# EAGLE design Teensy-Maxuino-Master (EAGLE 6.4)
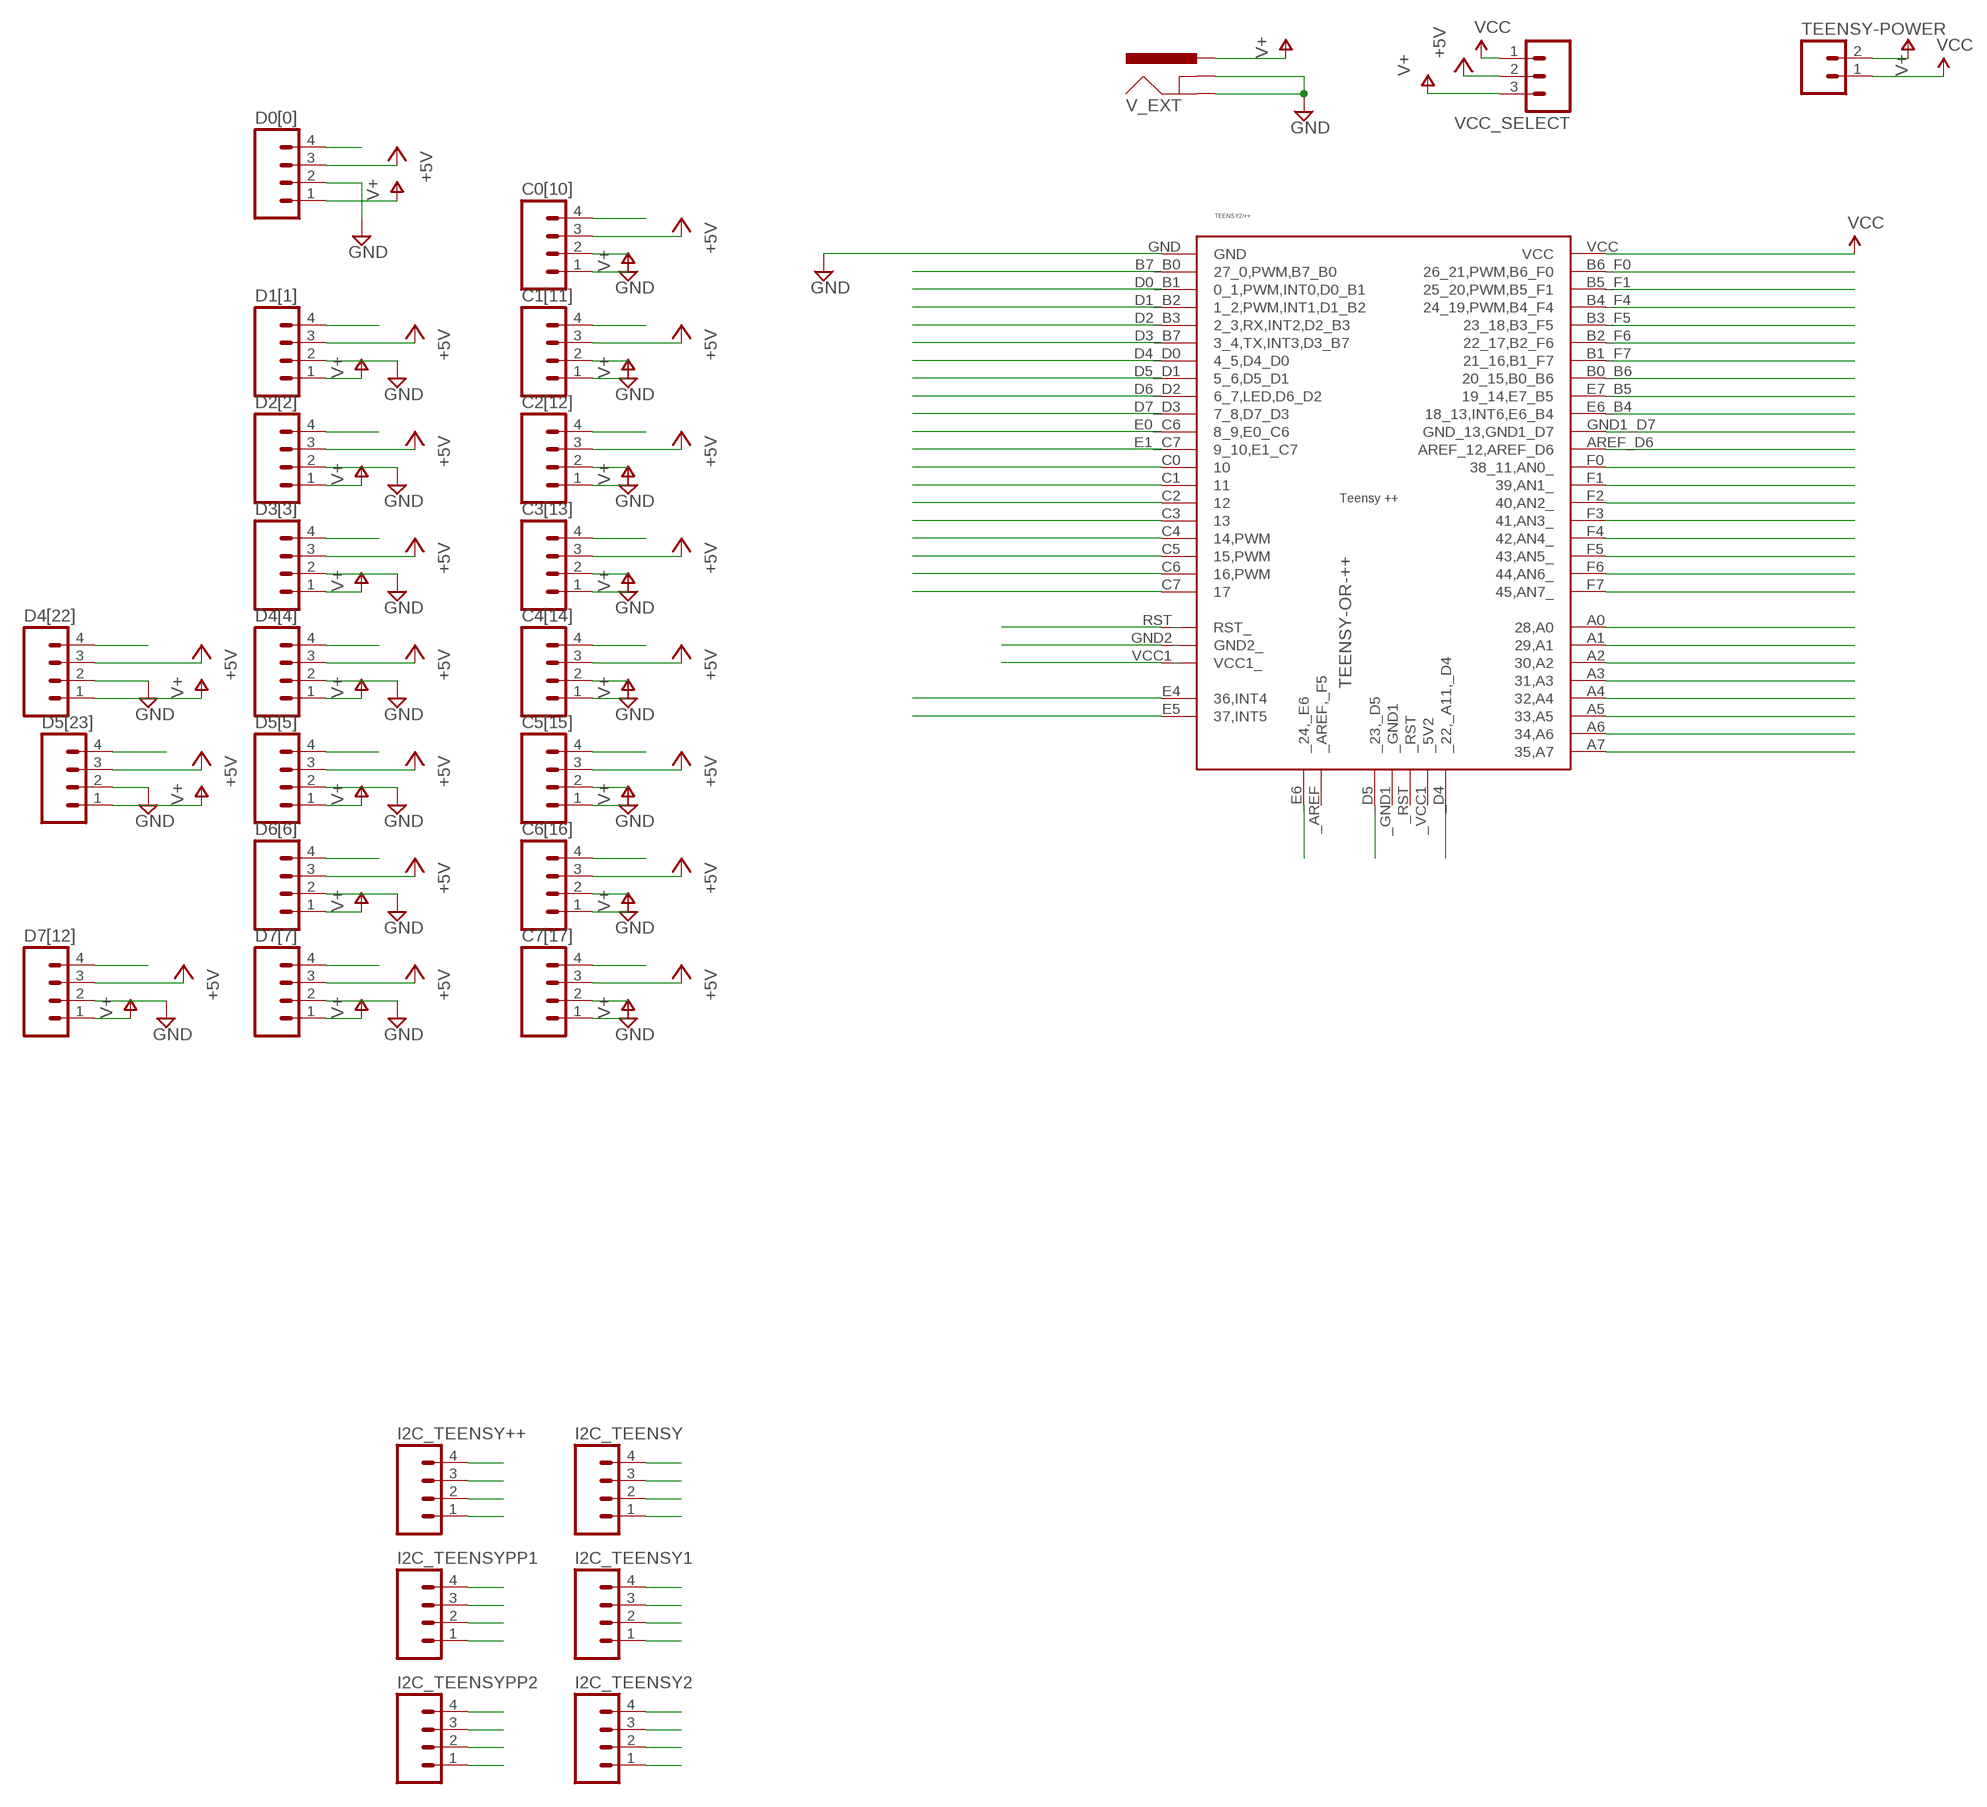
[diagram p0: schematic, sheet 1, part 1 of 2]
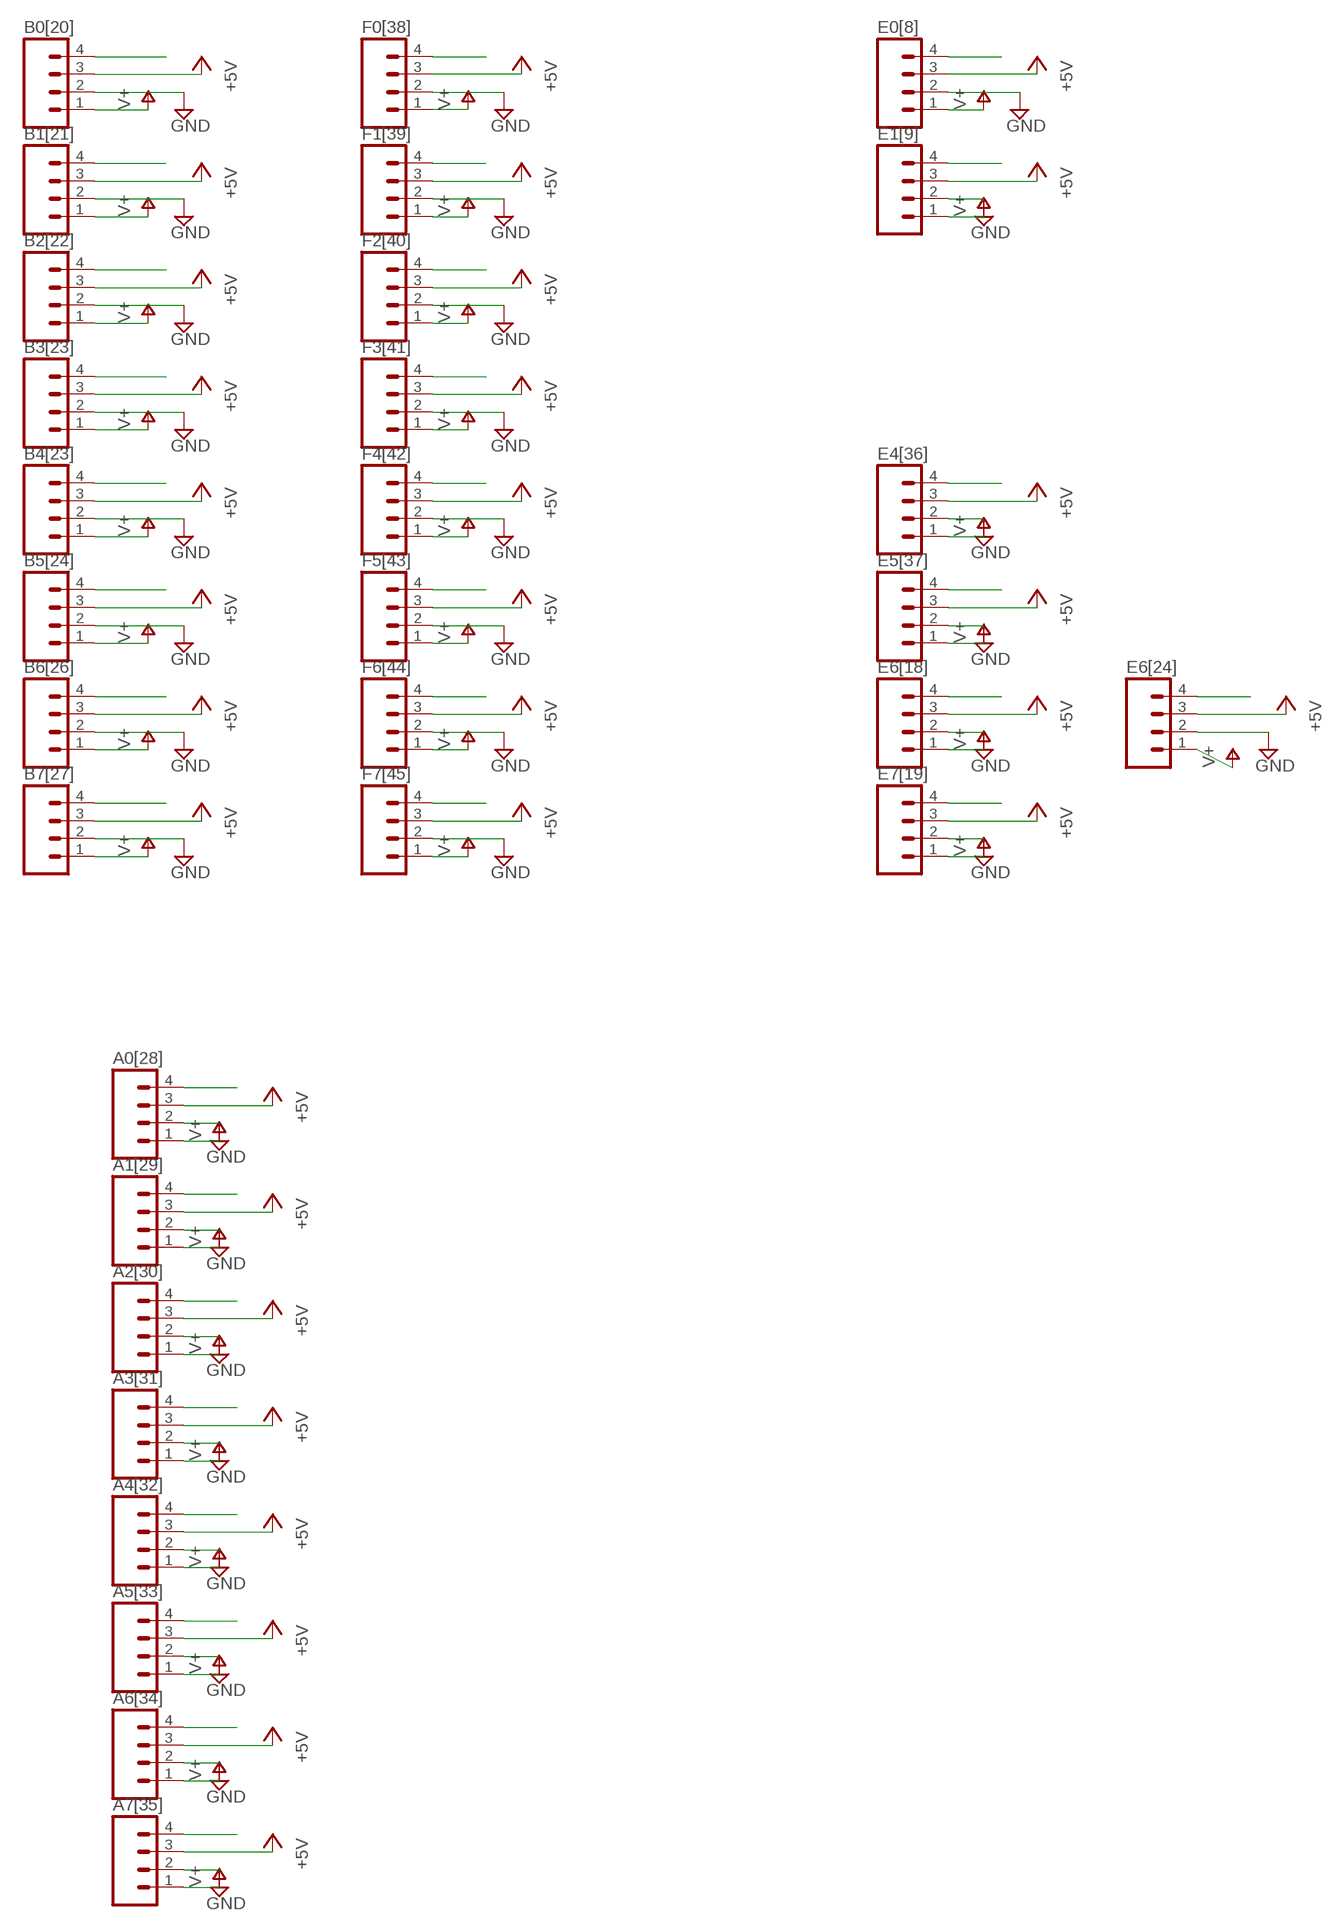
[diagram p1: schematic, sheet 1, part 2 of 2]

## Parts
A0[28]  M04PTH  [1X04]
A1[29]  M04PTH  [1X04]
A2[30]  M04PTH  [1X04]
A3[31]  M04PTH  [1X04]
A4[32]  M04PTH  [1X04]
A5[33]  M04PTH  [1X04]
A6[34]  M04PTH  [1X04]
A7[35]  M04PTH  [1X04]
B0[20]  M04PTH  [1X04]
B1[21]  M04PTH  [1X04]
B2[22]  M04PTH  [1X04]
B3[23]  M04PTH  [1X04]
B4[23]  M04PTH  [1X04]
B5[24]  M04PTH  [1X04]
B6[26]  M04PTH  [1X04]
B7[27]  M04PTH  [1X04]
C0[10]  M04PTH  [1X04]
C1[11]  M04PTH  [1X04]
C2[12]  M04PTH  [1X04]
C3[13]  M04PTH  [1X04]
C4[14]  M04PTH  [1X04]
C5[15]  M04PTH  [1X04]
C6[16]  M04PTH  [1X04]
C7[17]  M04PTH  [1X04]
D0[0]  M04PTH  [1X04]
D1[1]  M04PTH  [1X04]
D2[2]  M04PTH  [1X04]
D3[3]  M04PTH  [1X04]
D4[4]  M04PTH  [1X04]
D4[22]  M04PTH  [1X04]
D5[5]  M04PTH  [1X04]
D5[23]  M04PTH  [1X04]
D6[6]  M04PTH  [1X04]
D7[7]  M04PTH  [1X04]
D7[12]  M04PTH  [1X04]
E0[8]  M04PTH  [1X04]
E1[9]  M04PTH  [1X04]
E4[36]  M04PTH  [1X04]
E5[37]  M04PTH  [1X04]
E6[18]  M04PTH  [1X04]
E6[24]  M04PTH  [1X04]
E7[19]  M04PTH  [1X04]
F0[38]  M04PTH  [1X04]
F1[39]  M04PTH  [1X04]
F2[40]  M04PTH  [1X04]
F3[41]  M04PTH  [1X04]
F4[42]  M04PTH  [1X04]
F5[43]  M04PTH  [1X04]
F6[44]  M04PTH  [1X04]
F7[45]  M04PTH  [1X04]
I2C_TEENSY  M04PTH  [1X04]
I2C_TEENSY1  M04PTH  [1X04]
I2C_TEENSY2  M04PTH  [1X04]
I2C_TEENSY++  M04PTH  [1X04]
I2C_TEENSYPP1  M04PTH  [1X04]
I2C_TEENSYPP2  M04PTH  [1X04]
TEENSY2/++  TEENSY-OR-++  [TEENSY-OR-++]
TEENSY-POWER  M02PTH  [1X02]
V_EXT  POWER_JACKPTH  [POWER_JACK_PTH]
VCC_SELECT  M03PTH  [1X03]

## Nets
+5V [Power]: A0[28].3 A1[29].3 A2[30].3 A3[31].3 A4[32].3 A5[33].3 A6[34].3 A7[35].3 B0[20].3 B1[21].3 B2[22].3 B3[23].3 B4[23].3 B5[24].3 B6[26].3 B7[27].3 C0[10].3 C1[11].3 C2[12].3 C3[13].3 C4[14].3 C5[15].3 C6[16].3 C7[17].3 D0[0].3 D1[1].3 D2[2].3 D3[3].3 D4[4].3 D4[22].3 D5[5].3 D5[23].3 D6[6].3 D7[7].3 D7[12].3 E0[8].3 E1[9].3 E4[36].3 E5[37].3 E6[18].3 E6[24].3 E7[19].3 F0[38].3 F1[39].3 F2[40].3 F3[41].3 F4[42].3 F5[43].3 F6[44].3 F7[45].3 VCC_SELECT.2
_D4: D4[22].4 TEENSY2/++._D4(_22,_A11,_D4)
_D5: D5[23].4 TEENSY2/++._D5(_23,_D5)
_E6: E6[24].4 TEENSY2/++._E6(_24,_E6)
A0: A0[28].4 TEENSY2/++.A0(28,A0)
A1: A1[29].4 TEENSY2/++.A1(29,A1)
A2: A2[30].4 TEENSY2/++.A2(30,A2)
A3: A3[31].4 TEENSY2/++.A3(31,A3)
A4: A4[32].4 TEENSY2/++.A4(32,A4)
A5: A5[33].4 TEENSY2/++.A5(33,A5)
A6: A6[34].4 TEENSY2/++.A6(34,A6)
A7: A7[35].4 TEENSY2/++.A7(35,A7)
AREF_D6: TEENSY2/++.AREF_D6(AREF_12,AREF_D6)
B0_B6: B0[20].4 TEENSY2/++.B0_B6(20_15,B0_B6)
B1_F7: B1[21].4 TEENSY2/++.B1_F7(21_16,B1_F7)
B2_F6: B2[22].4 TEENSY2/++.B2_F6(22_17,B2_F6)
B3_F5: B3[23].4 TEENSY2/++.B3_F5(23_18,B3_F5)
B4_F4: B4[23].4 TEENSY2/++.B4_F4(24_19,PWM,B4_F4)
B5_F1: B5[24].4 TEENSY2/++.B5_F1(25_20,PWM,B5_F1)
B6_F0: B6[26].4 TEENSY2/++.B6_F0(26_21,PWM,B6_F0)
B7_B0: B7[27].4 TEENSY2/++.B7_B0(27_0,PWM,B7_B0)
C0: C0[10].4 TEENSY2/++.C0
C1: C1[11].4 TEENSY2/++.C1
C2: C2[12].4 TEENSY2/++.C2
C3: C3[13].4 TEENSY2/++.C3
C4: C4[14].4 TEENSY2/++.C4(14,PWM)
C5: C5[15].4 TEENSY2/++.C5(15,PWM)
C6: C6[16].4 TEENSY2/++.C6(16,PWM)
C7: C7[17].4 TEENSY2/++.C7
D0_B1: D0[0].4 I2C_TEENSY++.4 I2C_TEENSYPP1.4 I2C_TEENSYPP2.4 TEENSY2/++.D0_B1(0_1,PWM,INT0,D0_B1)
D1_B2: D1[1].4 I2C_TEENSY++.3 I2C_TEENSYPP1.3 I2C_TEENSYPP2.3 TEENSY2/++.D1_B2(1_2,PWM,INT1,D1_B2)
D2_B3: D2[2].4 TEENSY2/++.D2_B3(2_3,RX,INT2,D2_B3)
D3_B7: D3[3].4 TEENSY2/++.D3_B7(3_4,TX,INT3,D3_B7)
D4_D0: D4[4].4 I2C_TEENSY1.4 I2C_TEENSY2.4 I2C_TEENSY.4 TEENSY2/++.D4_D0(4_5,D4_D0)
D5_D1: D5[5].4 I2C_TEENSY1.3 I2C_TEENSY2.3 I2C_TEENSY.3 TEENSY2/++.D5_D1(5_6,D5_D1)
D6_D2: D6[6].4 TEENSY2/++.D6_D2(6_7,LED,D6_D2)
D7_D3: D7[7].4 TEENSY2/++.D7_D3(7_8,D7_D3)
E0_C6: E0[8].4 TEENSY2/++.E0_C6(8_9,E0_C6)
E1_C7: E1[9].4 TEENSY2/++.E1_C7(9_10,E1_C7)
E4: E4[36].4 TEENSY2/++.E4(36,INT4)
E5: E5[37].4 TEENSY2/++.E5(37,INT5)
E6_B4: E6[18].4 TEENSY2/++.E6_B4(18_13,INT6,E6_B4)
E7_B5: E7[19].4 TEENSY2/++.E7_B5(19_14,E7_B5)
F0: F0[38].4 TEENSY2/++.F0(38_11,AN0_)
F1: F1[39].4 TEENSY2/++.F1(39,AN1_)
F2: F2[40].4 TEENSY2/++.F2(40,AN2_)
F3: F3[41].4 TEENSY2/++.F3(41,AN3_)
F4: F4[42].4 TEENSY2/++.F4(42,AN4_)
F5: F5[43].4 TEENSY2/++.F5(43,AN5_)
F6: F6[44].4 TEENSY2/++.F6(44,AN6_)
F7: F7[45].4 TEENSY2/++.F7(45,AN7_)
GND [GND]: A0[28].2 A1[29].2 A2[30].2 A3[31].2 A4[32].2 A5[33].2 A6[34].2 A7[35].2 B0[20].2 B1[21].2 B2[22].2 B3[23].2 B4[23].2 B5[24].2 B6[26].2 B7[27].2 C0[10].2 C1[11].2 C2[12].2 C3[13].2 C4[14].2 C5[15].2 C6[16].2 C7[17].2 D0[0].2 D1[1].2 D2[2].2 D3[3].2 D4[4].2 D4[22].2 D5[5].2 D5[23].2 D6[6].2 D7[7].2 D7[12].2 E0[8].2 E1[9].2 E4[36].2 E5[37].2 E6[18].2 E6[24].2 E7[19].2 F0[38].2 F1[39].2 F2[40].2 F3[41].2 F4[42].2 F5[43].2 F6[44].2 F7[45].2 I2C_TEENSY1.1 I2C_TEENSY2.1 I2C_TEENSY++.1 I2C_TEENSY.1 I2C_TEENSYPP1.1 I2C_TEENSYPP2.1 TEENSY2/++.GND V_EXT.GND V_EXT.GNDBREAK
GND1_D7: D7[12].4 TEENSY2/++.GND1_D7(GND_13,GND1_D7)
GND2: TEENSY2/++.GND2_
NFO [Power]: A0[28].1 A1[29].1 A2[30].1 A3[31].1 A4[32].1 A5[33].1 A6[34].1 A7[35].1 B0[20].1 B1[21].1 B2[22].1 B3[23].1 B4[23].1 B5[24].1 B6[26].1 B7[27].1 C0[10].1 C1[11].1 C2[12].1 C3[13].1 C4[14].1 C5[15].1 C6[16].1 C7[17].1 D0[0].1 D1[1].1 D2[2].1 D3[3].1 D4[4].1 D4[22].1 D5[5].1 D5[23].1 D6[6].1 D7[7].1 D7[12].1 E0[8].1 E1[9].1 E4[36].1 E5[37].1 E6[18].1 E6[24].1 E7[19].1 F0[38].1 F1[39].1 F2[40].1 F3[41].1 F4[42].1 F5[43].1 F6[44].1 F7[45].1 TEENSY-POWER.2 V_EXT.PWR VCC_SELECT.3 ; supply symbol labelled V+
RST: TEENSY2/++.RST_
VCC: I2C_TEENSY1.2 I2C_TEENSY2.2 I2C_TEENSY++.2 I2C_TEENSY.2 I2C_TEENSYPP1.2 I2C_TEENSYPP2.2 TEENSY2/++.VCC TEENSY-POWER.1 VCC_SELECT.1
VCC1: TEENSY2/++.VCC1_
Unconnected: TEENSY2/++._AREF(_AREF,_F5) TEENSY2/++._GND1 TEENSY2/++._RST TEENSY2/++._VCC1(_5V2)

## Library data of the parts
A0[28] A1[29] A2[30] A3[31] A4[32] A5[33] A6[34] A7[35] B0[20] B1[21] B2[22] B3[23] B4[23] B5[24] B6[26] B7[27] C0[10] C1[11] C2[12] C3[13] C4[14] C5[15] C6[16] C7[17] D0[0] D1[1] D2[2] D3[3] D4[4] D4[22] D5[5] D5[23] D6[6] D7[7] D7[12] E0[8] E1[9] E4[36] E5[37] E6[18] E6[24] E7[19] F0[38] F1[39] F2[40] F3[41] F4[42] F5[43] F6[44] F7[45] I2C_TEENSY I2C_TEENSY1 I2C_TEENSY2 I2C_TEENSY++ I2C_TEENSYPP1 I2C_TEENSYPP2 = SparkFun-Connectors:M04: Header 4 Standard 4-pin 0.1" header. Use with straight break away headers (SKU : PRT-00116), right angle break away headers (PRT-00553), swiss pins (PRT-00743), machine pins (PRT-00117), and female headers (PRT-00115). Molex polarized connector foot print use with SKU : PRT-08231 with associated crimp pins and housings. 1MM SMD Version SKU: PRT-10208
TEENSY2/++ = teensy_ali:TEENSY-OR-++
TEENSY-POWER = SparkFun-Connectors:M02: Header 2 Standard 2-pin 0.1" header. Use with straight break away headers (SKU : PRT-00116), right angle break away headers (PRT-00553), swiss pins (PRT-00743), machine pins (PRT-00117), and female headers (PRT-00115). Molex polarized connector foot print use with SKU : PRT-08233 with associated crimp pins and housings.
V_EXT = SparkFun-Connectors:POWER_JACK: Power Jack This is the standard 5.5mm barrel jack for power. The PTH is the most common, proven, reliable, footprint. The Slot footprint only works if the mill layer is transmitted to the PCB fab house so be warned. Spark Fun Electronics SKU : PRT-00119 SMT: CONN-08106 Mating wall wart : TOL-00298 (and others)
VCC_SELECT = SparkFun-Connectors:M03: Header 3 Standard 3-pin 0.1" header. Use with straight break away headers (SKU : PRT-00116), right angle break away headers (PRT-00553), swiss pins (PRT-00743), machine pins (PRT-00117), and female headers (PRT-00115). Molex polarized connector foot print use with SKU : PRT-08232 with associated crimp pins and housings.

## Net classes
1 GND: width 0.457 mm
2 Power: width 0.813 mm

## Board
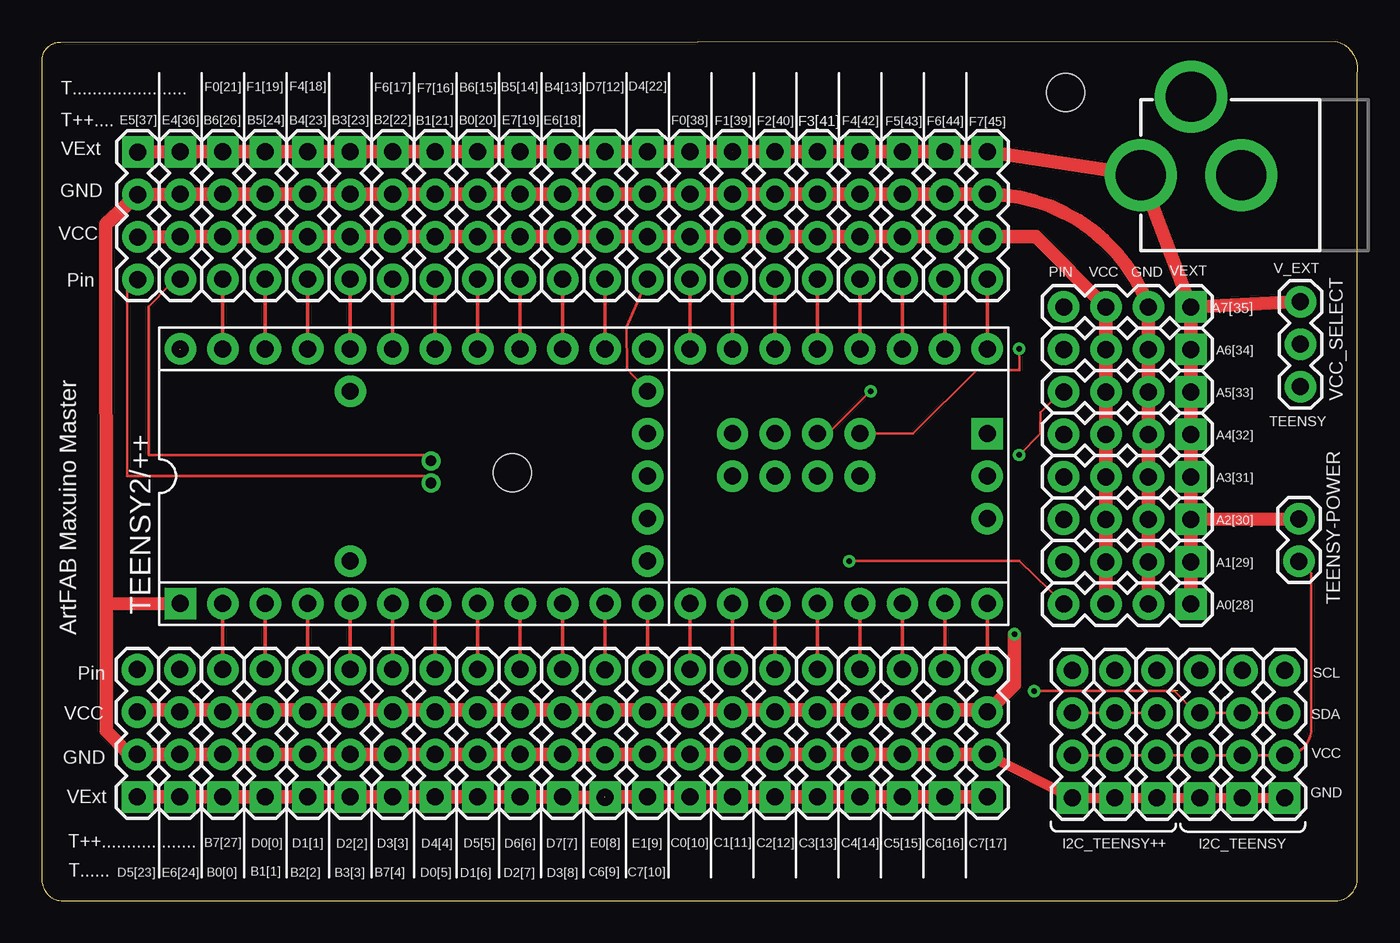
[diagram p2: board, top side]
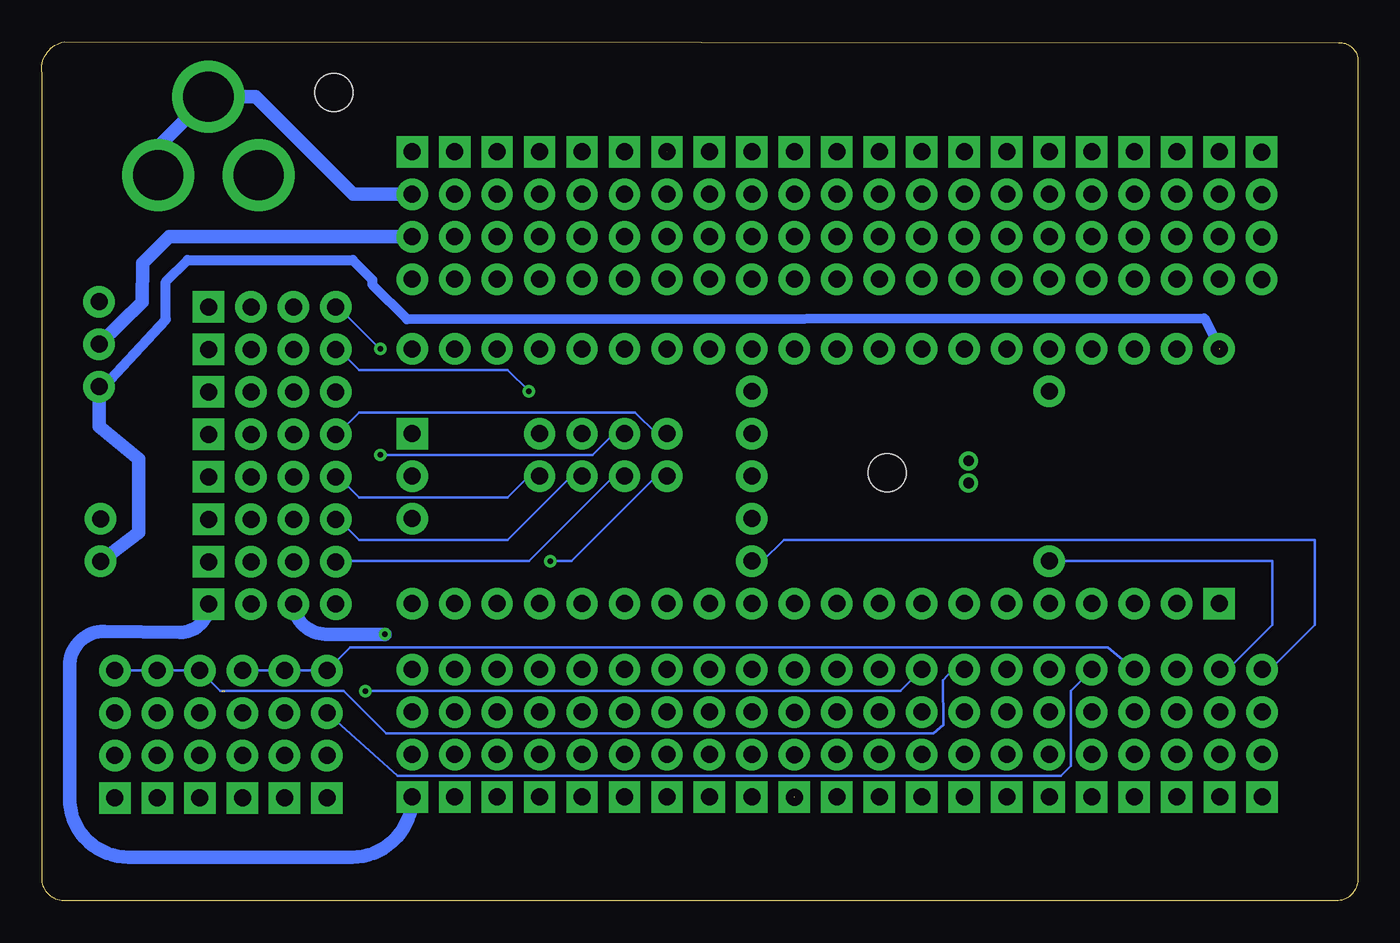
[diagram p3: board, bottom side, seen from below]

Size 78.69 x 51.39 mm. Coordinates in mm from the lower left corner, seen from the top.
Outline: 0,1.27 arc90 1.27,0 77.25,0 arc90 78.67,1.25 78.67,49.51 arc90 77.35,51.39 1.12,51.34 arc90 0,50.35 0,1.27
Copper layers (1*16): Top 0.035mm / dielectric 1.5mm / Bottom 0.035mm
Design rules: minimum track width 6mil, minimum drill 13mil, track to track 8mil, track to pad 8mil, pad to pad 8mil, via to via 8mil, smd to smd 8mil, copper to edge 40mil, drill to drill 8mil, minimum pad ring 10mil, minimum via ring 8mil, stop-mask expansion 4mil, vias tented up to drill 0mil, thermal gap 10mil
Holes 2.26 mm at 28.13,25.62 61.22,48.35

### Footprints (pad centres in the part's own frame; a part is rotated, then mirrored left to right if it is on the bottom)
1X04 = drill 1.016 pad 1.88 square: 1 0,0 | drill 1.016 pad 1.88: 2 2.54,0; 3 5.08,0; 4 7.62,0
TEENSY-OR-++ = drill 1.016 pad 1.88: _AREF -12.7,5.08; _D4 5.08,5.08; _D5 5.08,-5.08; _E6 -12.7,-5.08; _GND1 5.08,0; _RST 5.08,2.54; _VCC1 5.08,-2.54; A0 10.16,0; A1 12.7,0; A2 15.24,0; A3 17.78,0; A4 10.16,2.54; A5 12.7,2.54; A6 15.24,2.54; A7 17.78,2.54; AREF_D6 5.08,7.62; B0_B6 -5.08,7.62; B1_F7 -7.62,7.62; B2_F6 -10.16,7.62; B3_F5 -12.7,7.62; B4_F4 -15.24,7.62; B5_F1 -17.78,7.62; B6_F0 -20.32,7.62; B7_B0 -20.32,-7.62; C0 7.62,-7.62; C1 10.16,-7.62; C2 12.7,-7.62; C3 15.24,-7.62; C4 17.78,-7.62; C5 20.32,-7.62; C6 22.86,-7.62; C7 25.4,-7.62; D0_B1 -17.78,-7.62; D1_B2 -15.24,-7.62; D2_B3 -12.7,-7.62; D3_B7 -10.16,-7.62; D4_D0 -7.62,-7.62; D5_D1 -5.08,-7.62; D6_D2 -2.54,-7.62; D7_D3 0,-7.62; E0_C6 2.54,-7.62; E1_C7 5.08,-7.62; E6_B4 0,7.62; E7_B5 -2.54,7.62; F0 7.62,7.62; F1 10.16,7.62; F2 12.7,7.62; F3 15.24,7.62; F4 17.78,7.62; F5 20.32,7.62; F6 22.86,7.62; F7 25.4,7.62; GND1_D7 2.54,7.62; GND2_ 25.4,0; VCC -22.86,7.62; VCC1_ 25.4,-2.54 | drill 0.635 pad 1.067: E4 -7.874,0.914; E5 -7.874,-0.406 | drill 1.016 pad 1.88 square: GND -22.86,-7.62; RST_ 25.4,2.54
1X02 = drill 1.016 pad 1.88: 1 0,0; 2 2.54,0
POWER_JACK_PTH = drill 2.997 pad 4.318: GND 0,7.7; GNDBREAK 4.7,10.7; PWR 0,13.7
1X03 = drill 1.016 pad 1.88: 1 0,0; 2 2.54,0; 3 5.08,0

### Placement (x,y rotation side)
A0[28]  68.73,17.75 180 top
A1[29]  68.73,20.29 180 top
A2[30]  68.73,22.83 180 top
A3[31]  68.73,25.37 180 top
A4[32]  68.73,27.91 180 top
A5[33]  68.73,30.45 180 top
A6[34]  68.73,32.99 180 top
A7[35]  68.73,35.53 180 top
B0[20]  26.07,44.8 270 top
B1[21]  23.53,44.8 270 top
B2[22]  20.99,44.8 270 top
B3[23]  18.45,44.8 270 top
B4[23]  15.91,44.8 270 top
B5[24]  13.37,44.8 270 top
B6[26]  10.83,44.8 270 top
B7[27]  10.83,6.21 90 top
C0[10]  38.77,6.21 90 top
C1[11]  41.31,6.21 90 top
C2[12]  43.85,6.21 90 top
C3[13]  46.39,6.21 90 top
C4[14]  48.93,6.21 90 top
C5[15]  51.47,6.21 90 top
C6[16]  54.01,6.21 90 top
C7[17]  56.55,6.21 90 top
D0[0]  13.37,6.21 90 top
D1[1]  15.91,6.21 90 top
D2[2]  18.45,6.21 90 top
D3[3]  20.99,6.21 90 top
D4[4]  23.53,6.21 90 top
D4[22]  36.23,44.8 270 top
D5[5]  26.07,6.21 90 top
D5[23]  5.71,6.21 90 top
D6[6]  28.61,6.21 90 top
D7[7]  31.15,6.21 90 top
D7[12]  33.69,44.8 270 top
E0[8]  33.69,6.21 90 top
E1[9]  36.23,6.21 90 top
E4[36]  8.29,44.8 270 top
E5[37]  5.74,44.8 270 top
E6[18]  31.15,44.8 270 top
E6[24]  8.25,6.21 90 top
E7[19]  28.61,44.8 270 top
F0[38]  38.77,44.8 270 top
F1[39]  41.31,44.8 270 top
F2[40]  43.85,44.8 270 top
F3[41]  46.39,44.8 270 top
F4[42]  48.93,44.8 270 top
F5[43]  51.47,44.8 270 top
F6[44]  54.01,44.8 270 top
F7[45]  56.55,44.8 270 top
I2C_TEENSY  69.25,6.16 90 top
I2C_TEENSY1  71.79,6.16 90 top
I2C_TEENSY2  74.33,6.16 90 top
I2C_TEENSY++  61.64,6.16 90 top
I2C_TEENSYPP1  64.18,6.16 90 top
I2C_TEENSYPP2  66.7,6.16 90 top
TEENSY2/++  31.15,25.4 0 top
TEENSY-POWER  75.18,20.32 90 top
V_EXT  79.43,43.41 90 top
VCC_SELECT  75.26,30.76 90 top

### Tracks (layer width: path | path; a pad name or v marks a point on that pad's centre or on a via)
+5V  (via drill 0.33)
  Top 0.813: D5[23].3 6.38,11.43 7.65,11.43 E6[24].3 8.92,11.43 10.19,11.43 B7[27].3 11.46,11.43 12.73,11.43 D0[0].3 14,11.43 15.27,11.43 D1[1].3 16.54,11.43 17.81,11.43 D2[2].3 19.08,11.43 20.35,11.43 D3[3].3 21.62,11.43 22.89,11.43 D4[4].3 24.16,11.43 25.43,11.43 D5[5].3 26.7,11.43 27.97,11.43 D6[6].3 29.24,11.43 30.51,11.43 D7[7].3 31.78,11.43 33.05,11.43 E0[8].3 34.32,11.43 35.59,11.43 E1[9].3 36.86,11.43 38.13,11.43 C0[10].3 39.4,11.43 40.67,11.43 C1[11].3 41.94,11.43 43.21,11.43 C2[12].3 44.48,11.43 45.75,11.43 C3[13].3 47.02,11.43 48.29,11.43 C4[14].3 49.56,11.43 50.83,11.43 C5[15].3 52.1,11.43 53.37,11.43 C6[16].3 54.64,11.43 55.91,11.43 C7[17].3 58.17,12.91 v58.17,15.95 | A0[28].3 A1[29].3 A2[30].3 A3[31].3 A4[32].3 A5[33].3 A6[34].3 A7[35].3 59.46,39.72 F7[45].3 F6[44].3 F5[43].3 F4[42].3 F3[41].3 F2[40].3 F1[39].3 F0[38].3 D4[22].3 D7[12].3 E6[18].3 E7[19].3 B0[20].3 B1[21].3 B2[22].3 B3[23].3 B4[23].3 B5[24].3 B6[26].3 E4[36].3 E5[37].3
  Bottom 0.813: v58.17,15.95 61.55,15.95 arc90 A0[28].3 | F7[45].3 71.08,39.72 72.67,38.15 72.69,35.82 VCC_SELECT.2
_D4
  Top 0.152: D4[22].4 34.97,34.33 35,31.81 TEENSY2/++._D4
_D5
  Bottom 0.152: D5[23].4 5.11,13.97 2.57,16.51 2.57,21.59 34.32,21.59 35.59,20.32 TEENSY2/++._D5
_E6
  Bottom 0.152: TEENSY2/++._E6 5.11,20.32 5.11,16.51 7.65,13.97 E6[24].4
A0  (via drill 0.33)
  Top 0.152: v48.29,20.32 58.45,20.32 A0[28].4
  Bottom 0.152: v48.29,20.32 47.02,20.32 41.94,25.4 TEENSY2/++.A0
A1
  Bottom 0.152: TEENSY2/++.A1 44.48,25.4 49.56,20.32 60.99,20.32 A1[29].4
A2
  Bottom 0.152: TEENSY2/++.A2 47.02,25.4 50.83,21.59 59.72,21.59 60.99,22.86 A2[30].4
A3
  Bottom 0.152: A3[31].4 60.99,25.4 59.72,24.13 50.83,24.13 49.56,25.4 TEENSY2/++.A3
A4
  Bottom 0.152: A4[32].4 60.99,27.94 59.72,29.21 43.21,29.21 41.94,27.94 TEENSY2/++.A4
A5  (via drill 0.33)
  Top 0.152: v58.45,26.67 59.72,27.94 59.72,29.21 60.99,30.48 A5[33].4
  Bottom 0.152: v58.45,26.67 45.75,26.67 44.48,27.94 TEENSY2/++.A5
A6  (via drill 0.33)
  Top 0.152: v49.56,30.48 47.02,27.94 TEENSY2/++.A6
  Bottom 0.152: v49.56,30.48 50.83,31.75 59.72,31.75 60.99,33.02 A6[34].4
A7  (via drill 0.33)
  Top 0.152: TEENSY2/++.A7 52.1,27.94 55.91,31.75 58.45,31.75 v58.45,33.02
  Bottom 0.152: v58.45,33.02 60.99,35.56 A7[35].4
B0_B6
  Top 0.203: B0[20].4 TEENSY2/++.B0_B6
B1_F7
  Top 0.203: TEENSY2/++.B1_F7 B1[21].4
B2_F6
  Top 0.203: B2[22].4 TEENSY2/++.B2_F6
B3_F5
  Top 0.203: TEENSY2/++.B3_F5 B3[23].4
B4_F4
  Top 0.203: B4[23].4 TEENSY2/++.B4_F4
B5_F1
  Top 0.203: TEENSY2/++.B5_F1 B5[24].4
B6_F0
  Top 0.203: B6[26].4 TEENSY2/++.B6_F0
B7_B0
  Top 0.203: B7[27].4 TEENSY2/++.B7_B0
C0
  Top 0.203: TEENSY2/++.C0 C0[10].4
C1
  Top 0.203: C1[11].4 TEENSY2/++.C1
C2
  Top 0.203: TEENSY2/++.C2 C2[12].4
C3
  Top 0.203: C3[13].4 TEENSY2/++.C3
C4
  Top 0.203: TEENSY2/++.C4 C4[14].4
C5
  Top 0.203: C5[15].4 TEENSY2/++.C5
C6
  Top 0.203: TEENSY2/++.C6 C6[16].4
C7
  Top 0.203: C7[17].4 TEENSY2/++.C7
D0_B1
  Top 0.203: TEENSY2/++.D0_B1 D0[0].4
  Bottom 0.152: D0[0].4 14.95,15.16 60.26,15.16 I2C_TEENSY++.4 I2C_TEENSYPP1.4 I2C_TEENSYPP2.4
D1_B2
  Top 0.152: I2C_TEENSYPP2.3 I2C_TEENSYPP1.3 I2C_TEENSY++.3
  Top 0.203: D1[1].4 TEENSY2/++.D1_B2
  Bottom 0.152: D1[1].4 17.16,12.58 17.16,8.07 17.76,7.5 57.41,7.5 I2C_TEENSY++.3
D2_B3
  Top 0.203: TEENSY2/++.D2_B3 D2[2].4
D3_B7
  Top 0.203: D3[3].4 TEENSY2/++.D3_B7
D4_D0
  Top 0.203: TEENSY2/++.D4_D0 D4[4].4
  Bottom 0.152: I2C_TEENSY2.4 I2C_TEENSY1.4 I2C_TEENSY.4 68.01,12.55 60.66,12.55 58.12,10.01 25.38,10.01 24.78,10.53 24.79,13.19 24.19,13.83 D4[4].4
D5_D1  (via drill 0.33)  (1 unrouted)
  Top 0.152: I2C_TEENSY2.3 I2C_TEENSY1.3 I2C_TEENSY.3 69.02,11.24 67.72,12.55 v59.33,12.55
  Top 0.203: D5[5].4 TEENSY2/++.D5_D1
  Bottom 0.152: v59.33,12.55 27.35,12.55 D5[5].4
D6_D2
  Top 0.203: TEENSY2/++.D6_D2 D6[6].4
D7_D3
  Top 0.203: D7[7].4 TEENSY2/++.D7_D3
E0_C6
  Top 0.203: TEENSY2/++.E0_C6 E0[8].4
E1_C7
  Top 0.203: E1[9].4 TEENSY2/++.E1_C7
E4
  Top 0.152: TEENSY2/++.E4 22.89,26.67 6.38,26.67 6.38,35.56 7.65,36.83 E4[36].4
E5
  Top 0.152: TEENSY2/++.E5 22.89,25.4 5.11,25.4 5.11,36.83 E5[37].4
E6_B4
  Top 0.203: E6[18].4 TEENSY2/++.E6_B4
E7_B5
  Top 0.203: TEENSY2/++.E7_B5 E7[19].4
F0
  Top 0.203: F0[38].4 TEENSY2/++.F0
F1
  Top 0.203: TEENSY2/++.F1 F1[39].4
F2
  Top 0.203: F2[40].4 TEENSY2/++.F2
F3
  Top 0.203: TEENSY2/++.F3 F3[41].4
F4
  Top 0.203: F4[42].4 TEENSY2/++.F4
F5
  Top 0.203: TEENSY2/++.F5 F5[43].4
F6
  Top 0.203: F6[44].4 TEENSY2/++.F6
F7
  Top 0.203: TEENSY2/++.F7 F7[45].4
GND
  Top 0.61: I2C_TEENSY2.1 I2C_TEENSY1.1 I2C_TEENSY.1 I2C_TEENSYPP2.1 I2C_TEENSYPP1.1 I2C_TEENSY++.1 | I2C_TEENSY++.1 | C7[17].2 56.58,8.72 I2C_TEENSY++.1
  Top 0.813: 3.84,17.76 3.84,13.97 3.84,10.16 5.11,8.89 D5[23].2 E6[24].2 B7[27].2 D0[0].2 D1[1].2 D2[2].2 D3[3].2 D4[4].2 D5[5].2 D6[6].2 D7[7].2 E0[8].2 E1[9].2 C0[10].2 C1[11].2 C2[12].2 C3[13].2 C4[14].2 C5[15].2 C6[16].2 C7[17].2 | 3.84,17.76 3.82,40.49 E5[37].2 E4[36].2 B6[26].2 B5[24].2 B4[23].2 B3[23].2 B2[22].2 B1[21].2 B0[20].2 E7[19].2 E6[18].2 D7[12].2 D4[22].2 F0[38].2 F1[39].2 F2[40].2 F3[41].2 F4[42].2 F5[43].2 F6[44].2 F7[45].2 arc-70 A7[35].2 A6[34].2 A5[33].2 A4[32].2 A3[31].2 A2[30].2 A1[29].2 A0[28].2 | TEENSY2/++.GND 3.84,17.76
  Bottom 0.813: F7[45].2 60.06,42.26 65.91,48.11 V_EXT.GNDBREAK 71.72,45.11 V_EXT.GND
GND1_D7
  Top 0.203: TEENSY2/++.GND1_D7 D7[12].4
NFO  (2 unrouted)
  Top 0.813: D5[23].1 E6[24].1 B7[27].1 D0[0].1 D1[1].1 D2[2].1 D3[3].1 D4[4].1 D5[5].1 D6[6].1 D7[7].1 E0[8].1 | C7[17].1 C6[16].1 C5[15].1 C4[14].1 C3[13].1 C2[12].1 C1[11].1 C0[10].1 E1[9].1 E0[8].1 | A7[35].1 V_EXT.PWR F7[45].1 F6[44].1 F5[43].1 F4[42].1 F3[41].1 F2[40].1 F1[39].1 | A7[35].1 A6[34].1 A5[33].1 A4[32].1 A3[31].1 A2[30].1 | A2[30].1 A1[29].1 A0[28].1 | E5[37].1 E4[36].1 B6[26].1 B5[24].1 B4[23].1 B3[23].1 B2[22].1 B1[21].1 B0[20].1 E7[19].1 E6[18].1 D7[12].1 D4[22].1 F0[38].1 F1[39].1 | A7[35].1 VCC_SELECT.3 | TEENSY-POWER.2 A2[30].1
  Bottom 0.813: A0[28].1 arc90 70.42,16.06 74.95,16.13 arc-90 77.04,14.05 77.04,6.15 arc-90 73.51,2.62 60.14,2.62 arc-90 C7[17].1
VCC  (1 unrouted)
  Top 0.152: I2C_TEENSY++.2 I2C_TEENSYPP1.2 I2C_TEENSYPP2.2 arc-90 I2C_TEENSYPP2.2 I2C_TEENSY.2 I2C_TEENSY1.2 I2C_TEENSY2.2 arc90 75.92,10.3 75.92,19.58 TEENSY-POWER.1
  Bottom 0.61: 8.26,33 9.18,34.85 56.85,34.8 58.93,36.88 58.93,37.16 60.1,38.33 69.98,38.33 71.27,37.04 71.27,34.78 74.98,30.76 VCC_SELECT.1
  Bottom 0.813: VCC_SELECT.1 75.27,28.38 72.9,26.44 72.9,22.04 TEENSY-POWER.1

### Text on the board
tNames: T....................... | T++.... | ArtFAB Maxuino Master | T++................... | T......